# Altium schematic sheet Ultra-Mega-PS-PowerSupplies-V1.00.SchDoc: Ultra-Mega-PowerSupply
size A4; Author: Felipe Navarro; SheetNumber: 2; SheetTotal: 5
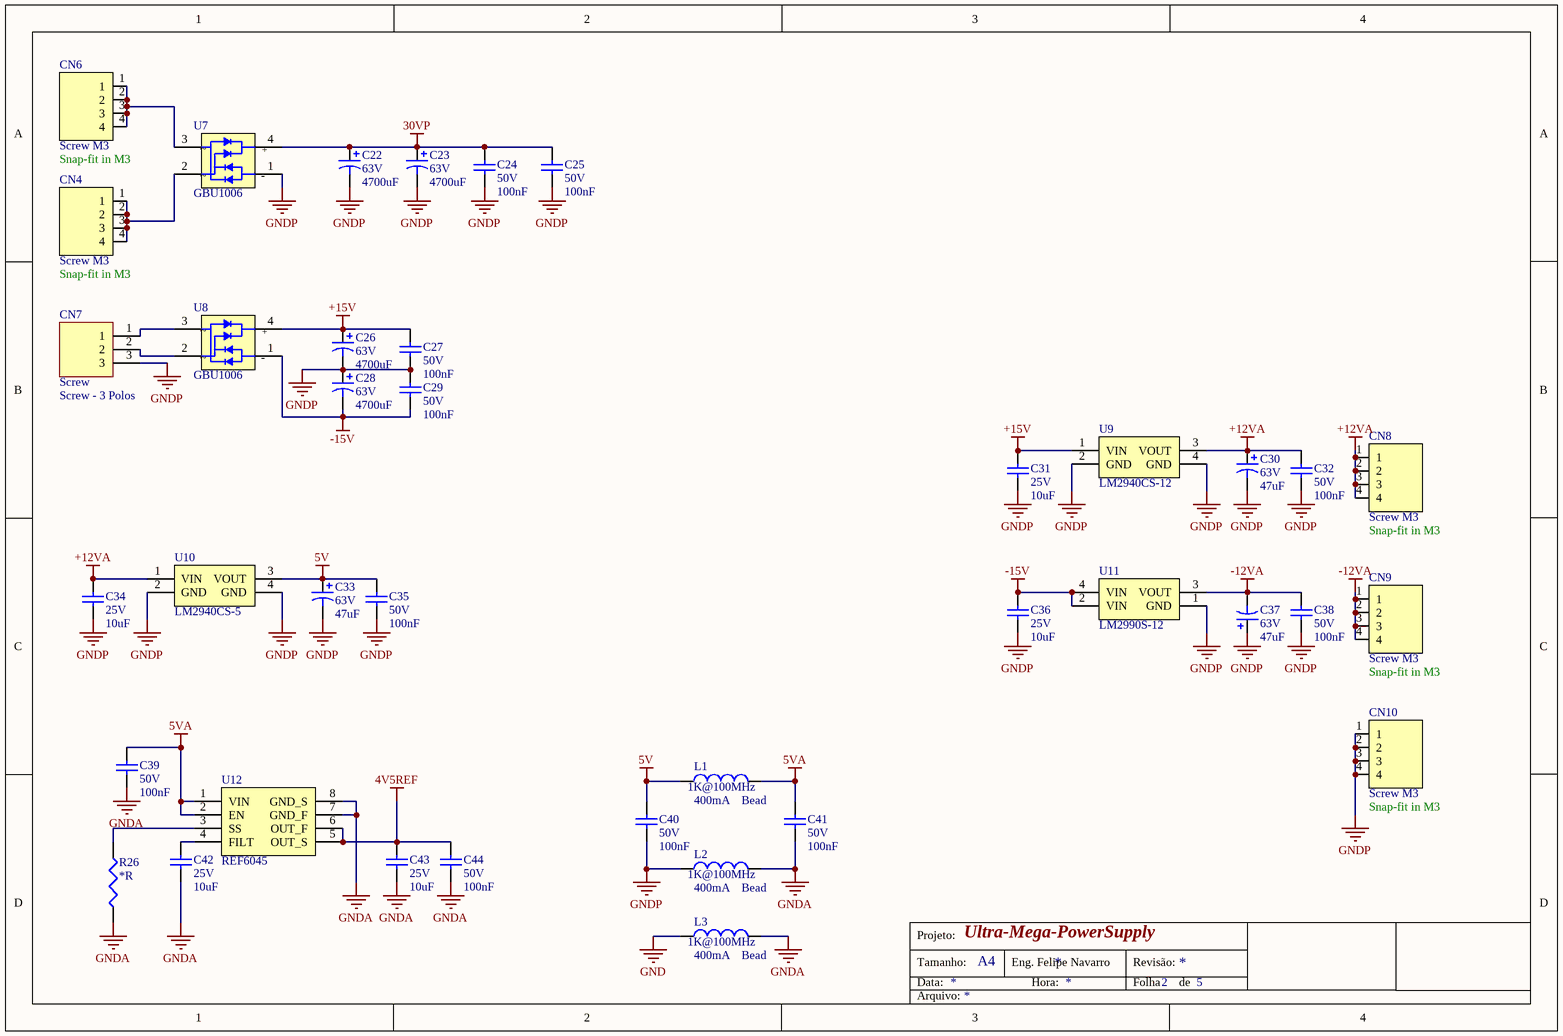
[diagram p0: Ultra-Mega-PS-PowerSupplies-V1.00.SchDoc]

## Parts
C22  value 4700uF  Tensão: 63V  [CAP NICHICON 25x40]  (hidden comment: Capacitor Eletrolítico)
C23  value 4700uF  Tensão: 63V  [CAP NICHICON 25x40]  (hidden comment: Capacitor Eletrolítico)
C24  value 100nF  Tensão: 50V  [CC0603]  (hidden comment: Capacitor Cerâmico)
C25  value 100nF  Tensão: 50V  [CC0603]  (hidden comment: Capacitor Cerâmico)
C26  value 4700uF  Tensão: 63V  [CAP NICHICON 25x40]  (hidden comment: Capacitor Eletrolítico)
C27  value 100nF  Tensão: 50V  [CC0603]  (hidden comment: Capacitor Cerâmico)
C28  value 4700uF  Tensão: 63V  [CAP NICHICON 25x40]  (hidden comment: Capacitor Eletrolítico)
C29  value 100nF  Tensão: 50V  [CC0603]  (hidden comment: Capacitor Cerâmico)
C30  value 47uF  Tensão: 63V  [CPOLRAD6X12]  (hidden comment: Capacitor Eletrolítico)
C31  value 10uF  Tensão: 25V  [CC0805]  (hidden comment: Capacitor Cerâmico)
C32  value 100nF  Tensão: 50V  [CC0603]  (hidden comment: Capacitor Cerâmico)
C33  value 47uF  Tensão: 63V  [CPOLRAD6X12]  (hidden comment: Capacitor Eletrolítico)
C34  value 10uF  Tensão: 25V  [CC0805]  (hidden comment: Capacitor Cerâmico)
C35  value 100nF  Tensão: 50V  [CC0603]  (hidden comment: Capacitor Cerâmico)
C36  value 10uF  Tensão: 25V  [CC0805]  (hidden comment: Capacitor Cerâmico)
C37  value 47uF  Tensão: 63V  [CPOLRAD6X12]  (hidden comment: Capacitor Eletrolítico)
C38  value 100nF  Tensão: 50V  [CC0603]  (hidden comment: Capacitor Cerâmico)
C39  value 100nF  Tensão: 50V  [CC0603]  (hidden comment: Capacitor Cerâmico)
C40  value 100nF  Tensão: 50V  [CC0603]  (hidden comment: Capacitor Cerâmico)
C41  value 100nF  Tensão: 50V  [CC0603]  (hidden comment: Capacitor Cerâmico)
C42  value 10uF  Tensão: 25V  [CC0805]  (hidden comment: Capacitor Cerâmico)
C43  value 10uF  Tensão: 25V  [CC0805]  (hidden comment: Capacitor Cerâmico)
C44  value 100nF  Tensão: 50V  [CC0603]  (hidden comment: Capacitor Cerâmico)
CN4  Screw M3  value Snap-fit in M3  [CONN_MASSA-M3]
CN6  Screw M3  value Snap-fit in M3  [CONN_MASSA-M3]
CN7  Screw  value Screw - 3 Polos  [CONN SCREW-3N P5.08]
CN8  Screw M3  value Snap-fit in M3  [CONN_MASSA-M3]
CN9  Screw M3  value Snap-fit in M3  [CONN_MASSA-M3]
CN10  Screw M3  value Snap-fit in M3  [CONN_MASSA-M3]
L1  Bead  value 1K@100MHz  Corrente: 400mA  [CC0603]
L2  Bead  value 1K@100MHz  Corrente: 400mA  [CC0603]
L3  Bead  value 1K@100MHz  Corrente: 400mA  [CC0603]
R26  value *R  [CC0603]  (hidden comment: Resistor)
U7  GBU1006  [GBU1006]
U8  GBU1006  [GBU1006]
U9  LM2940CS-12  [TO263-4N]
U10  LM2940CS-5  [TO263-4N]
U11  LM2990S-12  [TO263-4N]
U12  REF6045  [VFSOP-8N]

## Nets
4V5REF: C43.2 C44.2 U12.5(OUT_S) U12.6(OUT_F)
5V: C33.1 C35.2 C40.2 L1.1 U10.3(VOUT)
5VA: C39.2 C41.2 L1.2 U12.1(VIN) U12.2(EN)
30VP: C22.2 C23.2 C24.2 C25.2 U7.4(G)
+12VA: C30.1 C32.2 C34.2 CN8.1 CN8.2 CN8.3 CN8.4 U9.3(VOUT) U10.1(VIN)
+15V: C26.2 C27.2 C31.2 U8.4(G) U9.1(VIN)
-12VA: C37.2 C38.2 CN9.1 CN9.2 CN9.3 CN9.4 U11.3(VOUT)
-15V: C28.1 C29.1 C36.2 U8.1(S) U11.2(VIN) U11.4(VIN)
GND: L3.1
GNDA: C39.1 C41.1 C42.1 C43.1 C44.1 L2.2 L3.2 R26.1 U12.7(GND_F) U12.8(GND_S)
GNDP: C22.1 C23.1 C24.1 C25.1 C26.1 C27.1 C28.2 C29.2 C30.2 C31.1 C32.1 C33.2 C34.1 C35.1 C36.1 C37.1 C38.1 C40.1 CN7.3 CN10.1 CN10.2 CN10.3 CN10.4 L2.1 U7.1(S) U9.2(GND) U9.4(GND) U10.2(GND) U10.4(GND) U11.1(GND)
NetC42_2: C42.2 U12.4(FILT)
NetCN4_1: CN4.1 CN4.2 CN4.3 CN4.4 U7.2(AC)
NetCN6_1: CN6.1 CN6.2 CN6.3 CN6.4 U7.3(AC)
NetCN7_1: CN7.1 U8.3(AC)
NetCN7_2: CN7.2 U8.2(AC)
NetR26_2: R26.2 U12.3(SS)

## Notes on the sheet
- Projeto:
- Tamanho:
- Data:
- A4
- Eng. Felipe Navarro
- Hora:
- Revisão:
- Folha
- de
- Arquivo:
- (in symbol BRG GBU1006 600V 10A) ~; +; -

## Library data of the parts
C22 C23 C26 C28 = PCap 4700uF 63V: Polarized Capacitor (Radial); ChinesePrice: 0,00000; Chinês: ----; Corrente: *A; Potência: *W; Obs: ESH477M010AE3AA - Alumínio; Tolerância: ±20%; Supplier 1: Digi-Key; ComponentLink1Description: Datasheet; ComponentLink1URL: D:\Tecnoclade\Datasheet\!DataMissing.pdf
C24 C25 C27 C29 C32 C35 C38-C41 C44 = Cap 100nF 50V 0603 X7R: Capacitor (Semiconductor SIM Model); Chinês: Local; ChinesePrice: 0,00250; Corrente: *A; Potência: *W; Obs:: X7R; Tolerância: ±10%; Supplier 1: Digi-Key; Supplier Part Number 1: 1276-1000-1-ND; ComponentLink1Description: Datasheet; ComponentLink1URL: D:\Tecnoclade\Datasheet\!DataMissing.pdf
C30 C33 C37 = PCap 47uF 63V 6d.x12h.: Polarized Capacitor (Radial); ChinesePrice: 0,00000; Chinês: ----; Corrente: *A; Potência: *W; Obs: Alumínio; Tolerância: ±20%; Supplier 1: Digi-Key; Supplier Part Number 1: 493-12934-1-ND; ComponentLink1Description: Datasheet; ComponentLink1URL: D:\Tecnoclade\Datasheet\!DataMissing.pdf
C31 C34 C36 C42 C43 = Cap 10uF 25V 0805 X5R: Capacitor (Semiconductor SIM Model); Chinês: Local; ChinesePrice: 0,02620; Corrente: *A; Potência: *W; Obs:: X5R; Tolerância: ±10%; Supplier 1: Digi-Key; Supplier Part Number 1: 587-2985-1-ND; ComponentLink1Description: Datasheet; ComponentLink1URL: D:\Tecnoclade\Datasheet\!DataMissing.pdf
CN4 CN6 CN8-CN10 = Screw Snap-Fit M3: TERM PCB SNAP-IN VERT M3 THREAD; ChinesePrice: 0,00000; Chinês: -----; Corrente: 15A; Obs:: Screw Terminal, Power Tap; Potência: *; Supplier 1: Digi-Key; Supplier Part Number 1: 7788K-ND; Tensão: *; Tolerância: *; ComponentLink1Description: Datasheet; ComponentLink1URL: D:\Tecnoclade\Datasheet\!DataMissing.pdf
CN7 = Screw-3 125V 6A P2.54mm: Conector Screw Block; ChinesePrice: 0,00000; Chinês: ----; Corrente: 6A; Tensão: 125V; Obs:: Through Hole, M1.6; Tolerância: 20-30 AWG; Potência: *; Supplier 1: Digi-Key; ComponentLink1Description: Datasheet; ComponentLink1URL: D:\Tecnoclade\Datasheet\!DataMissing.pdf
L1-L3 = Bd 1K@100MHz 0603 400mA: ChinesePrice: 0,00000; Chinês: -----; Obs:: Ferrite (0R5); Tolerância: ±25%; Potência: *; Supplier 1: Digi-Key; Supplier Part Number 1: 445-1550-1-ND; Tensão: *; ComponentLink1Description: Datasheet; ComponentLink1URL: D:\Tecnoclade\Datasheet\!DataMissing.pdf; Substituição: 27/06/2014
R26 = Res - $Val $% $Footprint $Pot: ChinesePrice: 0,00000; Chinês: ----; Corrente: *A; Potência: 1/10W; Tensão: *V; Tolerância: ±*%; Supplier 1: Digi-Key; Supplier Part Number 1: --Del; Obs:: *; ComponentLink1Description: Datasheet; ComponentLink1URL: D:\Tecnoclade\Datasheet\!DataMissing.pdf
U7 U8 = BRG GBU1006 600V 10A: 600V 10A; ChinesePrice: 0,00000; Chinês: ----; Corrente: 500mA; Potência: *W; Tensão: 20V; Value: Ponte Retificadora; Tolerância: ±*%; Supplier 1: Digi-Key; Supplier Part Number 1: GBU1006DI-ND; Obs:: *; ComponentLink1Description: Datasheet; ComponentLink1URL: D:\Tecnoclade\Datasheet\!DataMissing.pdf
U9 U10 = LM2940-15: Regulador Linear 15V Positivo; Chinês: ----; Corrente: 1A; ChinesePrice: 0,00000; Obs:: LDO; Potência: *; Value: *; Supplier 1: Digi-Key; Supplier Part Number 1: LM2940CS-15/NOPB-ND; Tensão: 15V; Tolerância: *; ComponentLink1Description: Datasheet; ComponentLink1URL: D:\Tecnoclade\Datasheet\
U11 = LM2990-15: Regulador Linear 15V Negativo; Chinês: ----; Tensão: -15V; Corrente: 1.8A; ChinesePrice: 0,00000; Obs:: LDO; Potência: *; Value: *; Supplier 1: Digi-Key; Supplier Part Number 1: LM2990S-15/NOPB-ND; Tolerância: *; ComponentLink1Description: Datasheet; ComponentLink1URL: D:\Tecnoclade\Datasheet\
U12 = REF6050: REF60xx High-Precision Voltage Reference With Integrated ADC Drive Buffer; ChinesePrice: 1,94000; Chinês: Local; Corrente: *; Potência: *; Supplier 1: Digi-Key; Supplier Part Number 1: *; Tensão: *; Obs:: *; Tolerância: *; ComponentLink1Description: Datasheet; ComponentLink1URL: D:\Tecnoclade\Datasheet\!DataMissing.pdf